# EAGLE design Simple-Bug-BC547 (EAGLE 7.2.0)
Simple FM Transmitter with Electret Microphone, based on NPN Transistor
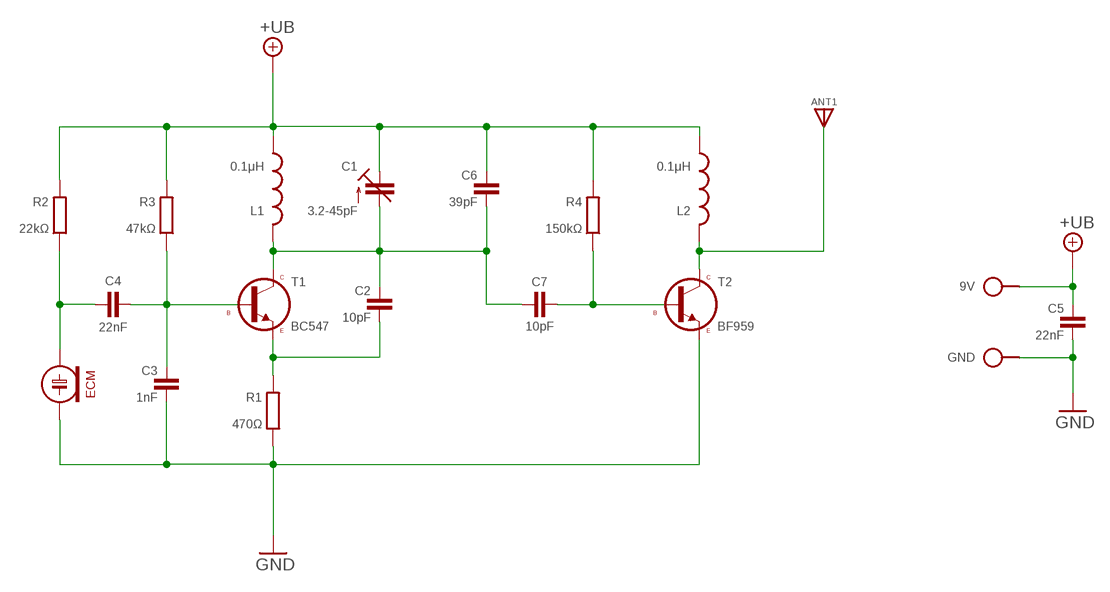
[diagram p0: schematic, sheet 1]

## Parts
9V  SPAD  [SPAD@1]
ANT1  ANT  [SPAD]
C1  3.2-45pF  C-TR-PH201272222-808-2PIN  [TRIM-2222-808]
C2  10pF  C025-015X024  [C025-015X024]
C3  1nF  C025-020X036  [C025-020X036]
C4  22nF  C050-020X044  [C050-020X044]
C5  22nF  C050-020X036/V  [C050-020X036/V]
C6  39pF  C025-015X024  [C025-015X024]
C7  10pF  C-H025-015X024  [C025-015X024]
ECM  ECM-5  [ECM-5]
GND  SPAD  [SPAD@1]
L1  0.1μH  L08-10/5  [L-08-10/5]
L2  0.1μH  L08-10/5  [L-08-10/5]
R1  470Ω  R0204/10  [0204/10]
R2  22kΩ  R0204/10-V  [0204/10-V]
R3  47kΩ  R0204/10-V  [0204/10-V]
R4  150kΩ  R0204/10-V  [0204/10-V]
T1  BC547  [TO92]
T2  BF959  [TO92-CEB]

## Nets
+UB: 9V.1 C1.2(E) C5.1 C6.1 L1.2 L2.2 R2.1 R3.1 R4.1
GND: C3.2 C5.2 ECM.2(-) GND.1 R1.2 T2.E
N$1: ANT1.1 L2.1 T2.C
N$2: C1.1(A) C2.1 C6.2 C7.1 L1.1 T1.1(C)
N$3: C2.2 R1.1 T1.3(E)
N$4: C7.2 R4.2 T2.B
N$5: C3.1 C4.2 R3.2 T1.2(B)
N$6: C4.1 ECM.1(+) R2.2

## Library data of the parts
9V GND = pad:SPAD
ANT1 = pad:ANT
C1 = cap-trim:C-TR-PH20127
C2-C6 = c:C: CAPACITOR, European symbol
C7 = c:C-H
ECM = ECM:ECM
L1 L2 = l:L: Potentiometers Beckman, Copal, Piher, Spectrol, Schukat Created by librarian@cadsoft.de
R1-R4 = r:R: RESISTOR, European symbol
T1 = t:BC547
T2 = t:BF959

## Net classes
0 default: width 0.61 mm

## Board
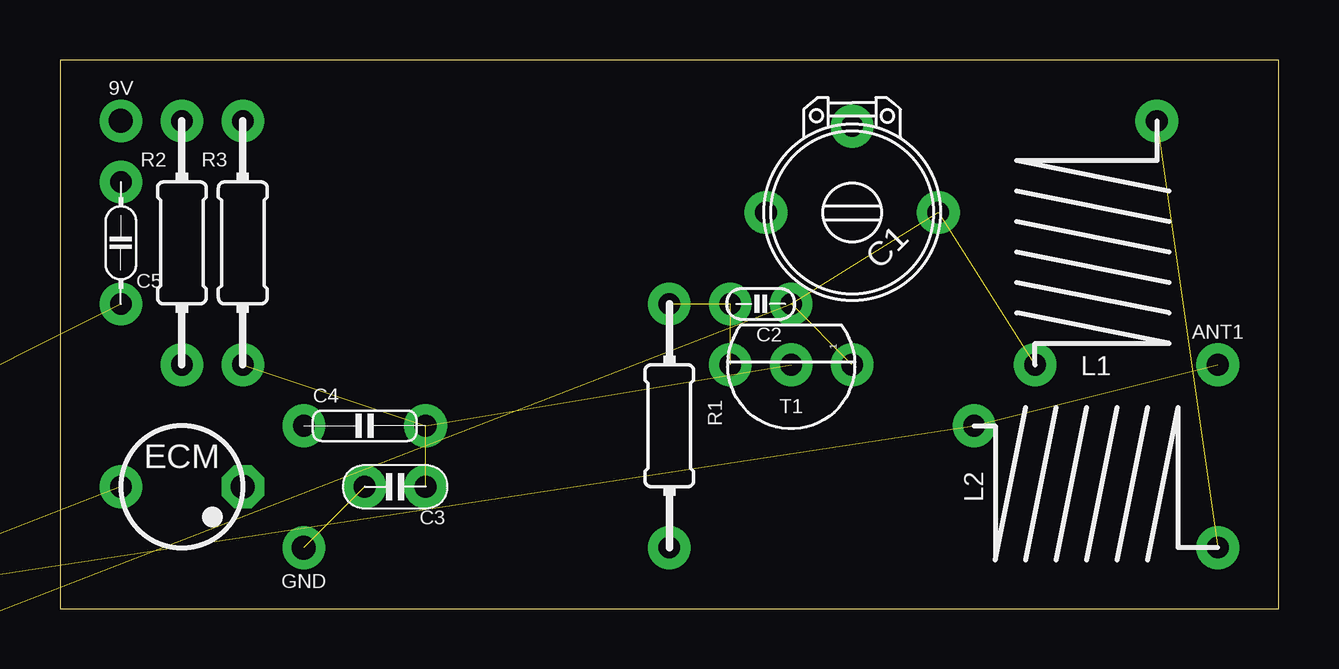
[diagram p1: board, top side]
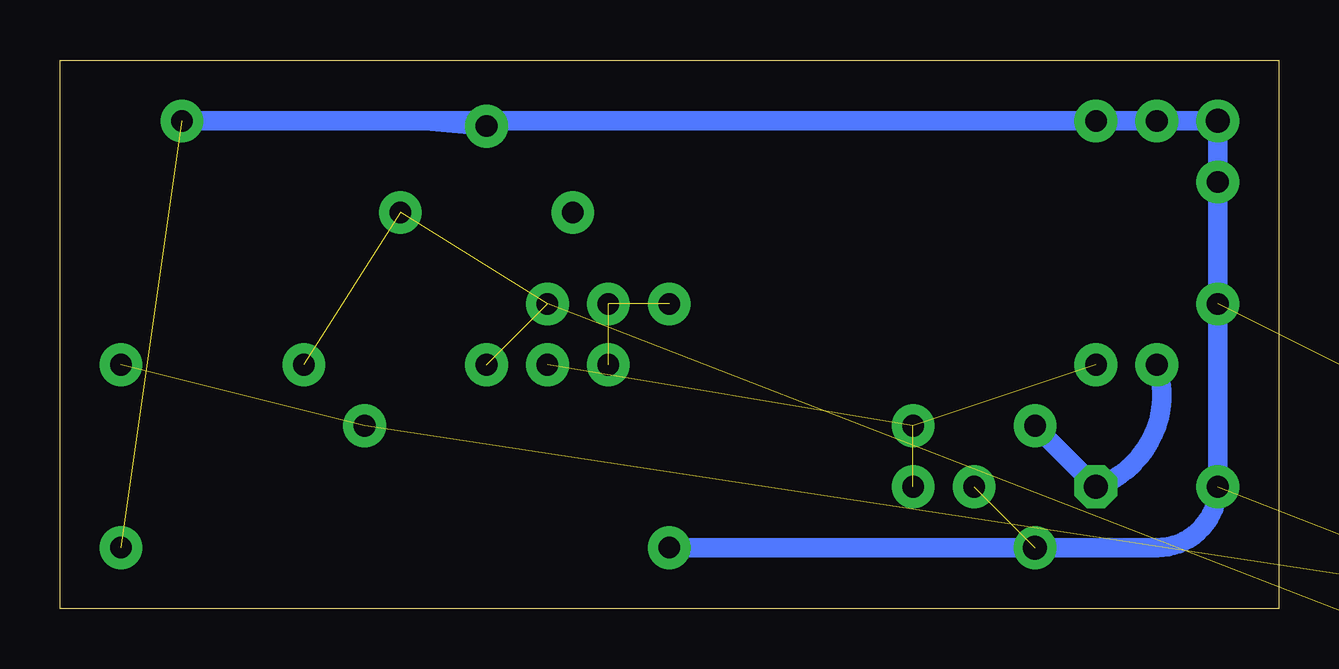
[diagram p2: board, bottom side, seen from below]

Size 50.8 x 22.86 mm. Coordinates in mm from the lower left corner, seen from the top.
Outline: 0,0 50.8,0 50.8,22.86 0,22.86 0,0
Copper layers (1*16): Top 0.035mm / dielectric 1.5mm / Bottom 0.035mm
Design rules "default": minimum track width 10mil, minimum drill 24mil, track to track 8mil, track to pad 8mil, pad to pad 8mil, via to via 8mil, smd to smd 8mil, copper to edge 40mil, drill to drill 8mil, minimum pad ring 10mil, minimum via ring 8mil, stop-mask expansion 4mil, vias tented up to drill 0mil, thermal gap 10mil

### Footprints (pad centres in the part's own frame; a part is rotated, then mirrored left to right if it is on the bottom)
SPAD@1 = drill 1 pad 1.778: 1 0,0
SPAD = drill 0.9 pad 1.778: 1 0,0
TRIM-2222-808 = drill 0.9 pad 1.778: 1 -2.54,2.54; 2 -2.54,-2.54; 3 2.54,-2.54
C025-015X024 = drill 0.9 pad 1.778: 1 -1.27,0; 2 1.27,0
C025-020X036 = drill 0.9 pad 1.778: 1 0,0; 2 2.54,0
C050-020X044 = drill 0.9 pad 1.778: 1 -2.54,0; 2 2.54,0
C050-020X036/V = drill 0.9 pad 1.778: 1 0,2.54; 2 0,-2.54
ECM-5 = drill 1 pad 1.778 octagon: 1 0,2.54 | drill 0.9 pad 1.778: 2 0,-2.54
L-08-10/5 = drill 0.9 pad 1.778: 1 2.54,5.08; 2 -2.54,-5.08
0204/10 = drill 0.9 pad 1.778: 1 -5.08,0; 2 5.08,0
0204/10-V = drill 0.9 pad 1.778: 1 0,5.08; 2 0,-5.08
TO92 = drill 0.9 pad 1.778: 1 0,2.54; 2 0,0; 3 0,-2.54
TO92-CEB = drill 0.9 pad 1.778: B 0,-2.54; C 0,2.54; E 0,0

### Placement (x,y rotation side)
9V  2.54,20.32 270 top
ANT1  48.26,10.16 270 top
C1  33.02,16.51 225 top
C2  29.21,12.7 180 top
C3  15.24,5.08 180 top
C4  12.7,7.62 0 top
C5  2.54,15.24 180 top
C6  -10.16,-2.54 0 top  (outside the outline)
C7  -10.16,-6.35 0 top  (outside the outline)
ECM  5.08,5.08 270 top
GND  10.16,2.54 90 top
L1  43.18,15.24 180 top
L2  43.18,5.08 90 top
R1  25.4,7.62 270 top
R2  5.08,15.24 0 top
R3  7.62,15.24 0 top
R4  -15.24,-1.27 0 top  (outside the outline)
T1  30.48,10.16 270 top
T2  -20.32,-3.81 0 top  (outside the outline)

### Tracks (layer width: path | path; a pad name or v marks a point on that pad's centre or on a via)
+UB  (3 unrouted)
  Bottom 0.813: C5.1 9V.1 R2.1 R3.1 35.56,20.32 | 35.56,20.32 L1.2 | C1.2 35.56,20.32
GND  (2 unrouted)
  Bottom 0.813: R1.2 GND.1 5.08,2.54 arc-90 ECM.2 C5.2
N$1  (2 unrouted)
N$2  (5 unrouted)
N$3  (2 unrouted)
N$4  (2 unrouted)
N$5  (3 unrouted)
N$6
  Bottom 0.813: R2.2 arc90 ECM.1 C4.1